# EasyEDA Pro project BLDCV6-nerdyintern.eprj, board PCB4
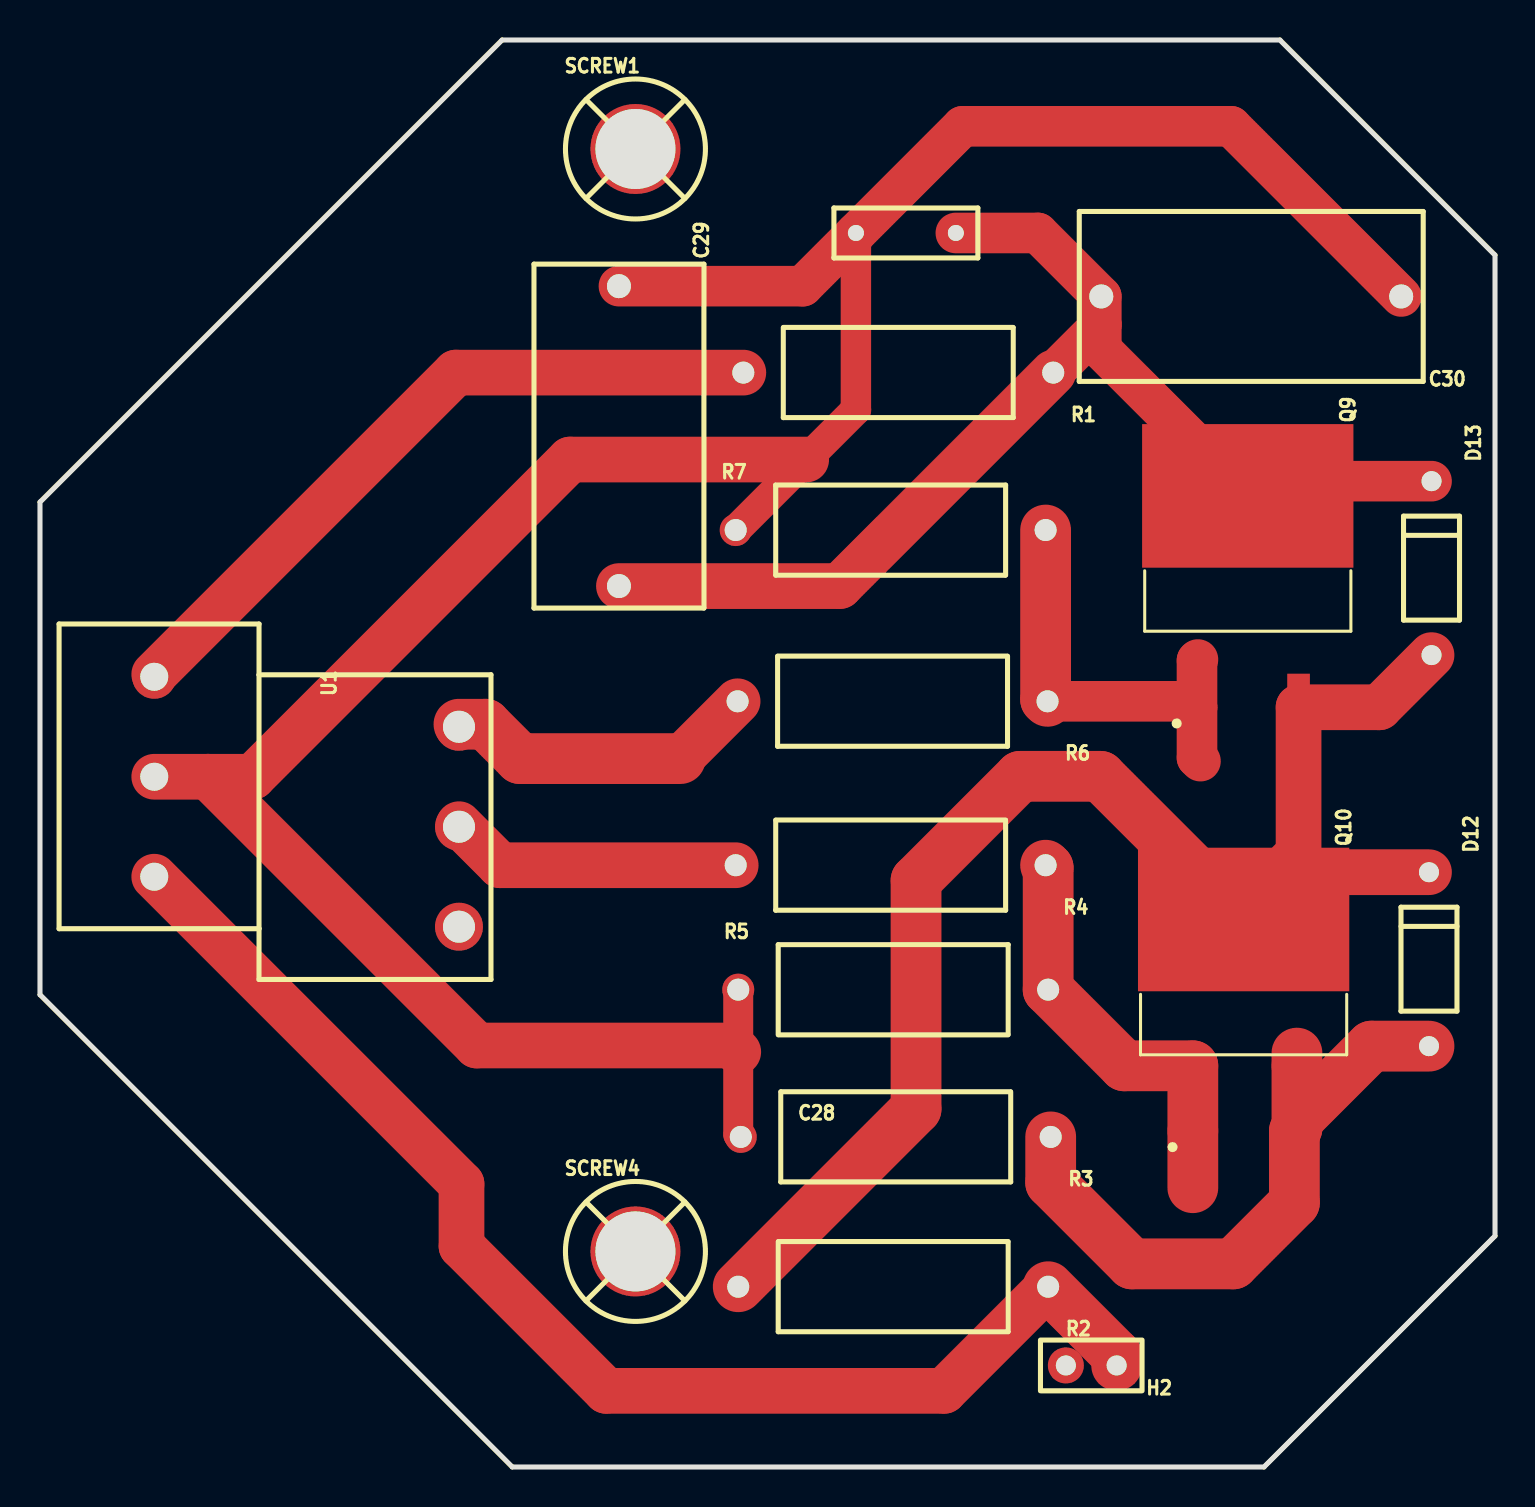
[diagram p11: board, top side]
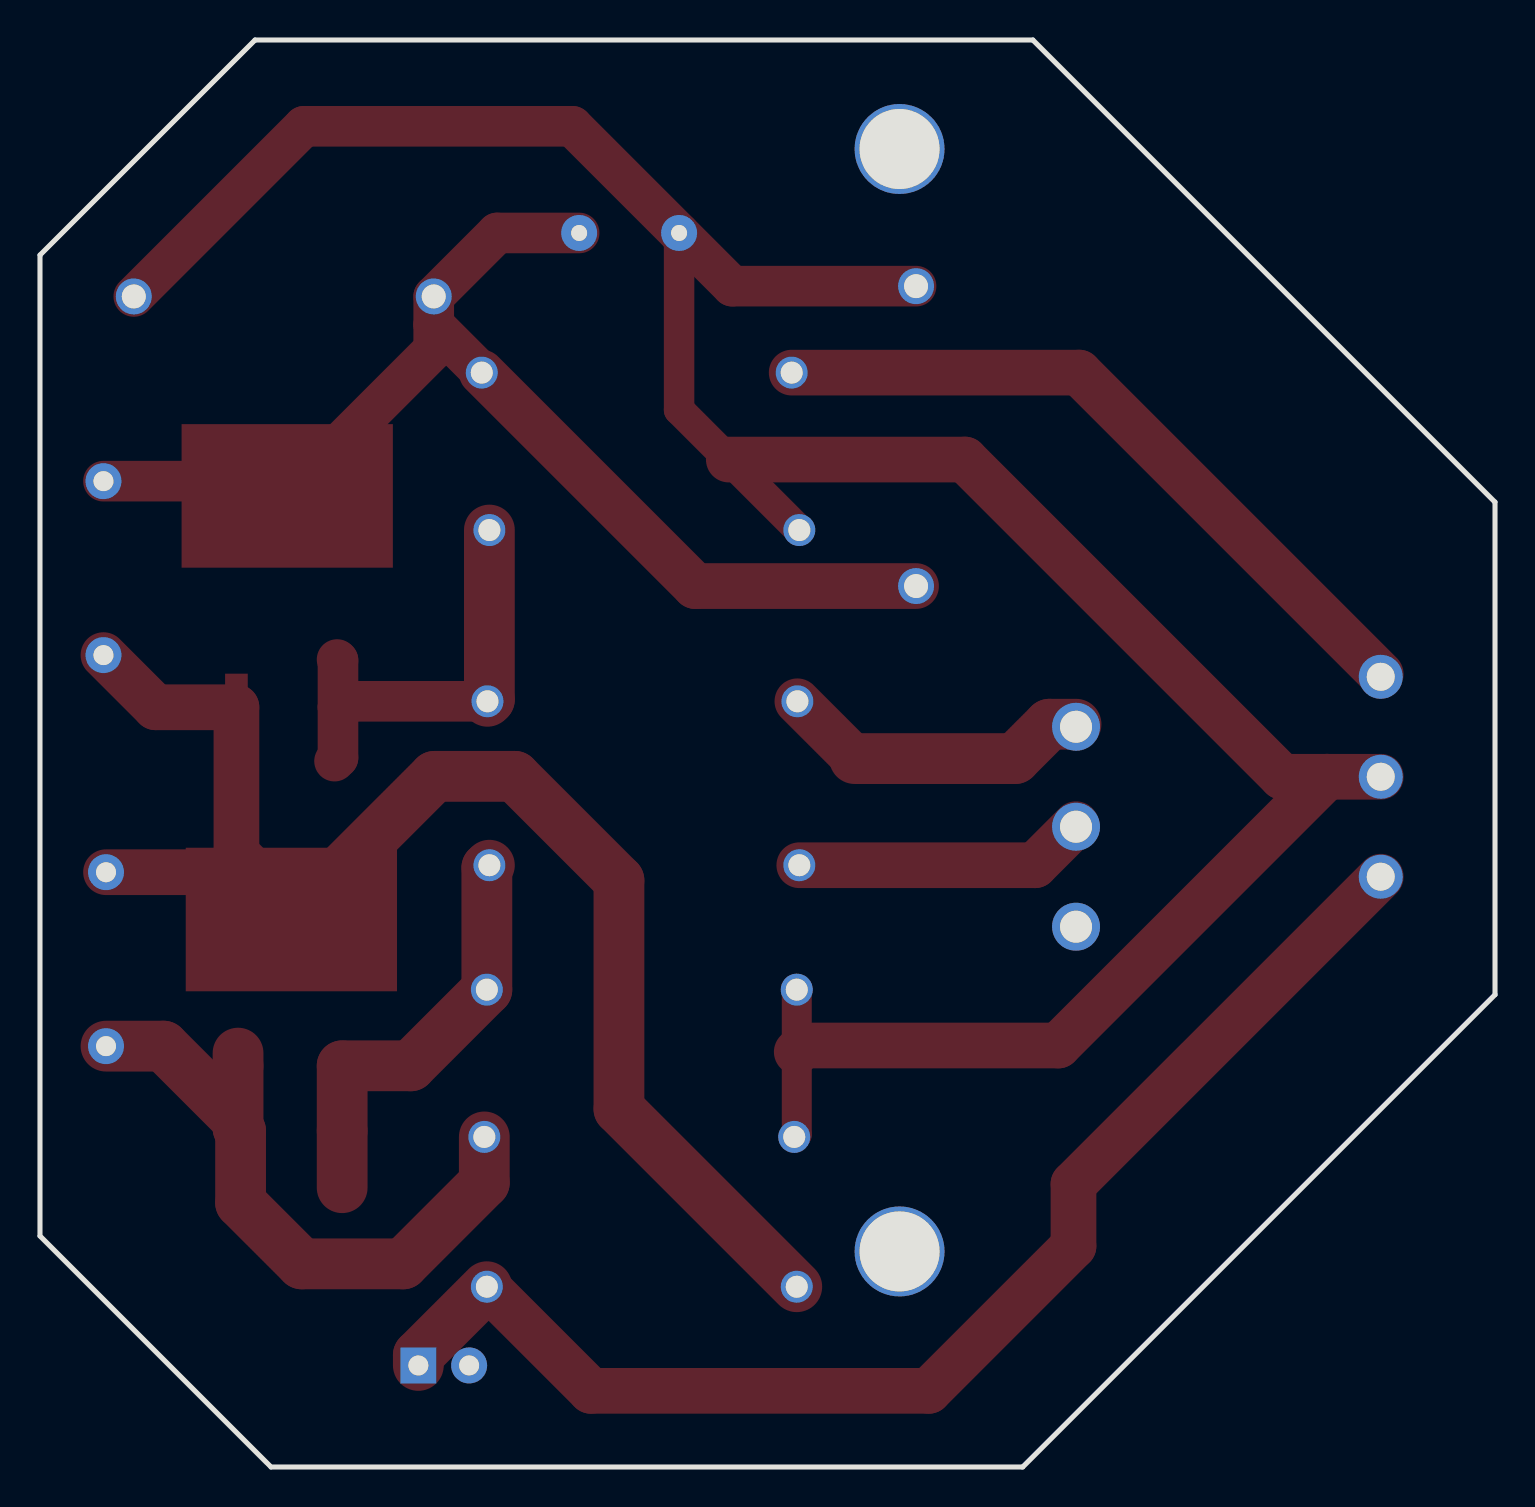
[diagram p12: board, bottom side, seen from below]

Outline 72.77 x 71.37 mm; copper layers: Top Layer, Bottom Layer. Coordinates in mm from the lower left corner of the outline.
Outline path: 0,48.26 0,23.62 23.62,0 61.21,0 72.77,11.56 72.77,60.62 62.01,71.37 23.11,71.37 0,48.26
Stack: Top Layer 0.035mm / Dielectric1 1.51mm FR4 er 4.5 / Bottom Layer 0.035mm

## Design rules (mm)
template: Custom Config
spacing copperThickness1oz (default): track to track 0.75, other pairs 0.152 to 0.3
spacing copperThickness2oz: track to track 0.203, other pairs 0.152 to 0.3
track width copperThickness1oz (default): min 0.127, default 0.254, max 2.54
track width copperThickness2oz: min 0.203, default 0.254, max 2.54
differential pair differentialPair (default): width min 0.127, default 0.254, max 2.54; gap min 0.152, default 0.152
via viaSize (default): diameter min 0.5, default 0.61, max 10; hole min 0.3, default 0.305, max 6.3

## Placement (name value [footprint] x y rotation side)
C28  1uF  [CAP-TH_L7.2-W2.5-P5.00-D0.6]  43.31 61.72 180 top
C29  1uF  [CAP-TH_L17.0-W8.5-P15.00-D0.8]  28.96 51.56 270 top
C30  1uF  [CAP-TH_L17.0-W8.5-P15.00-D0.8]  60.58 58.55 180 top
D12  -  [DO-41_BD2.4-L4.7-P8.70-D0.9-RD]  69.47 25.4 270 top
D13  -  [DO-41_BD2.4-L4.7-P8.70-D0.9-RD]  69.6 44.96 270 top
H2  -  [HDR-TH_2P-P2.54-V-M-1]  52.58 5.08 180 top
Q9  IRFS4010TRLPBF  [D2PAK_L9.1-W10.0-P2.54-LS15.3-BR-1]  60.41 43.28 270 top
Q10  IRFS4010TRLPBF  [D2PAK_L9.1-W10.0-P2.54-LS15.3-BR-1]  60.2 22.1 270 top
R1  10kΩ  [RES-TH_BD4.5-L11.5-P15.50-D0.8]  42.93 54.74 180 top
R2  10kΩ  [RES-TH_BD4.5-L11.5-P15.50-D0.8]  42.67 9.02 180 top
R3  10kΩ  [RES-TH_BD4.5-L11.5-P15.50-D0.8]  42.8 16.51 180 top
R4  10kΩ  [RES-TH_BD4.5-L11.5-P15.50-D0.8]  42.54 30.1 180 top
R5  10kΩ  [RES-TH_BD4.5-L11.5-P15.50-D0.8]  42.67 23.88 0 top
R6  10kΩ  [RES-TH_BD4.5-L11.5-P15.50-D0.8]  42.64 38.3 180 top
R7  10kΩ  [RES-TH_BD4.5-L11.5-P15.50-D0.8]  42.54 46.86 0 top
SCREW1  -  [Screw-Hole-M4]  29.78 65.92 0 top
SCREW4  -  [Screw-Hole-M4]  29.78 10.78 0 top
U1  DB128B-5.0-2*3P-OG-S  [CONN-TH_DB128B-5.0-3P-XX-S]  13.33 33.27 270 top

## Footprints (pads in the part's own frame, mm; a bottom-side part is the same pattern mirrored in y, then rotated)
CAP-TH_L7.2-W2.5-P5.00-D0.6
  round 1.8 hole 0.8: 1(-2.499,0) 2(2.499,0)
CAP-TH_L17.0-W8.5-P15.00-D0.8
  round 1.8 hole 1.2: 1(-7.5,0) 2(7.5,0)
CONN-TH_DB128B-5.0-3P-XX-S
  round 2.2 hole 1.4: 1(-6.25,-7.62) 2(-1.25,-7.62) 3(3.75,-7.62)
  round 2.4 hole 1.6: 4(6.25,7.62) 5(1.25,7.62) 6(-3.75,7.62)
D2PAK_L9.1-W10.0-P2.54-LS15.3-BR-1
  rect 3.358x1.134 smd: 1(5.285,-2.54) 3(5.285,2.54)
  rect 7.181x10.566 smd: 4(-5.286,0)
DO-41_BD2.4-L4.7-P8.70-D0.9-RD
  round 1.8 hole 1: 1(-4.35,0) 2(4.35,0)
HDR-TH_2P-P2.54-V-M-1
  rect 1.8x1.8 hole 1: 1(-1.27,0)
  round 1.8 hole 1: 2(1.27,0)
RES-TH_BD4.5-L11.5-P15.50-D0.8
  round 1.6 hole 1.1: 1(-7.75,0) 2(7.75,0)
Screw-Hole-M4
  round 4.5 hole 4: 1(0,0)

## Nets
As in the schematic.

Pads without a net: SCREW1 1; SCREW4 1; U1 4

## Routing (per net, layer and track width the routed paths; a pad name or vN(x,y) marks a point on that pad's centre or on a via; arc(x,y) is an arc through that point)
GND: length 142.1
  Top Layer w1.498: R5.1 34.92,16.64 R3.2
  Top Layer w1.524: C28.2 40.81,52.88 R7.1
  Top Layer w2.032: C29.1 38.15,59.06 C28.2 46.14,67.06 59.57,67.06 C30.1
  Top Layer w2.286: 38.32,50.39 26.51,50.39 10.65,34.52 8.4,34.52 ; 8.4,34.52 U1.2 ; 8.4,34.52 21.84,21.08 34.6,21.08 34.92,20.76
VCC: length 35.7
  Top Layer w2.286: R1.2 20.8,54.74 5.72,39.65
HSGATE: length 21.4
  Top Layer w2.032: Q9.1 57.87,40.34 57.91,40.39 ; Q9.1 57.87,35.48 58.04,35.31 ; Q9.1 57.57,38.3 R6.1
  Top Layer w2.54: R6.1 50.29,38.39 R7.2
HSS: length 60.6
  Top Layer w2.032: 53.08,57.14 C30.2 49.9,61.72 C28.1 ; 53.08,57.14 53.08,55.9 Q9.4 61.14,49.31 D13.1 ; 53.08,57.14 R1.1
  Top Layer w2.286: C29.2 40,44.06 R1.1
LSD: length 36.8
  Top Layer w1.524: 62.99,16.56 Q10.3
  Top Layer w2.032: 62.87,20.07 62.99,17.45 62.99,16.56
  Top Layer w2.54: 62.99,17.45 66.59,21.05 D12.2 ; R3.1 50.55,14.22 54.61,10.16 59.68,10.16 62.74,13.22 Q10.3 62.87,16.94 62.87,20.7
LSGATE: length 21.2
  Top Layer w2.54: R4.1 50.42,29.97 R5.2 54.23,20.07 57.66,20.07 Q10.1 57.66,13.97
SN_OUT: length 64.7
  Top Layer w2.286: R2.1 45.22,3.81 28.32,3.81 21.08,11.05 21.08,14.16 U1.3
  Top Layer w2.54: R2.1 53.85,5.59 H2.1
SWITCH_NODE: length 73.1
  Top Layer w2.286: 61.34,29.08 62.95,30.69 Q9.3 66.99,38 D13.2 ; Q10.4 62.56,29.75 D12.1
  Top Layer w2.54: R2.2 43.81,17.91 43.81,29.34 49.02,34.54 53.04,34.54 Q10.4
$1N1078: length 15.8
  Top Layer w2.286: 32.03,35.43 R6.2
  Top Layer w2.54: 32.03,35.43 24,35.43 22.28,37.15 20.96,37.15
$1N1105: length 14.7
  Top Layer w2.286: R4.2 23.01,30.1 20.96,32.15
